# EAGLE design PrototypeMcu (EAGLE 9.2.2)
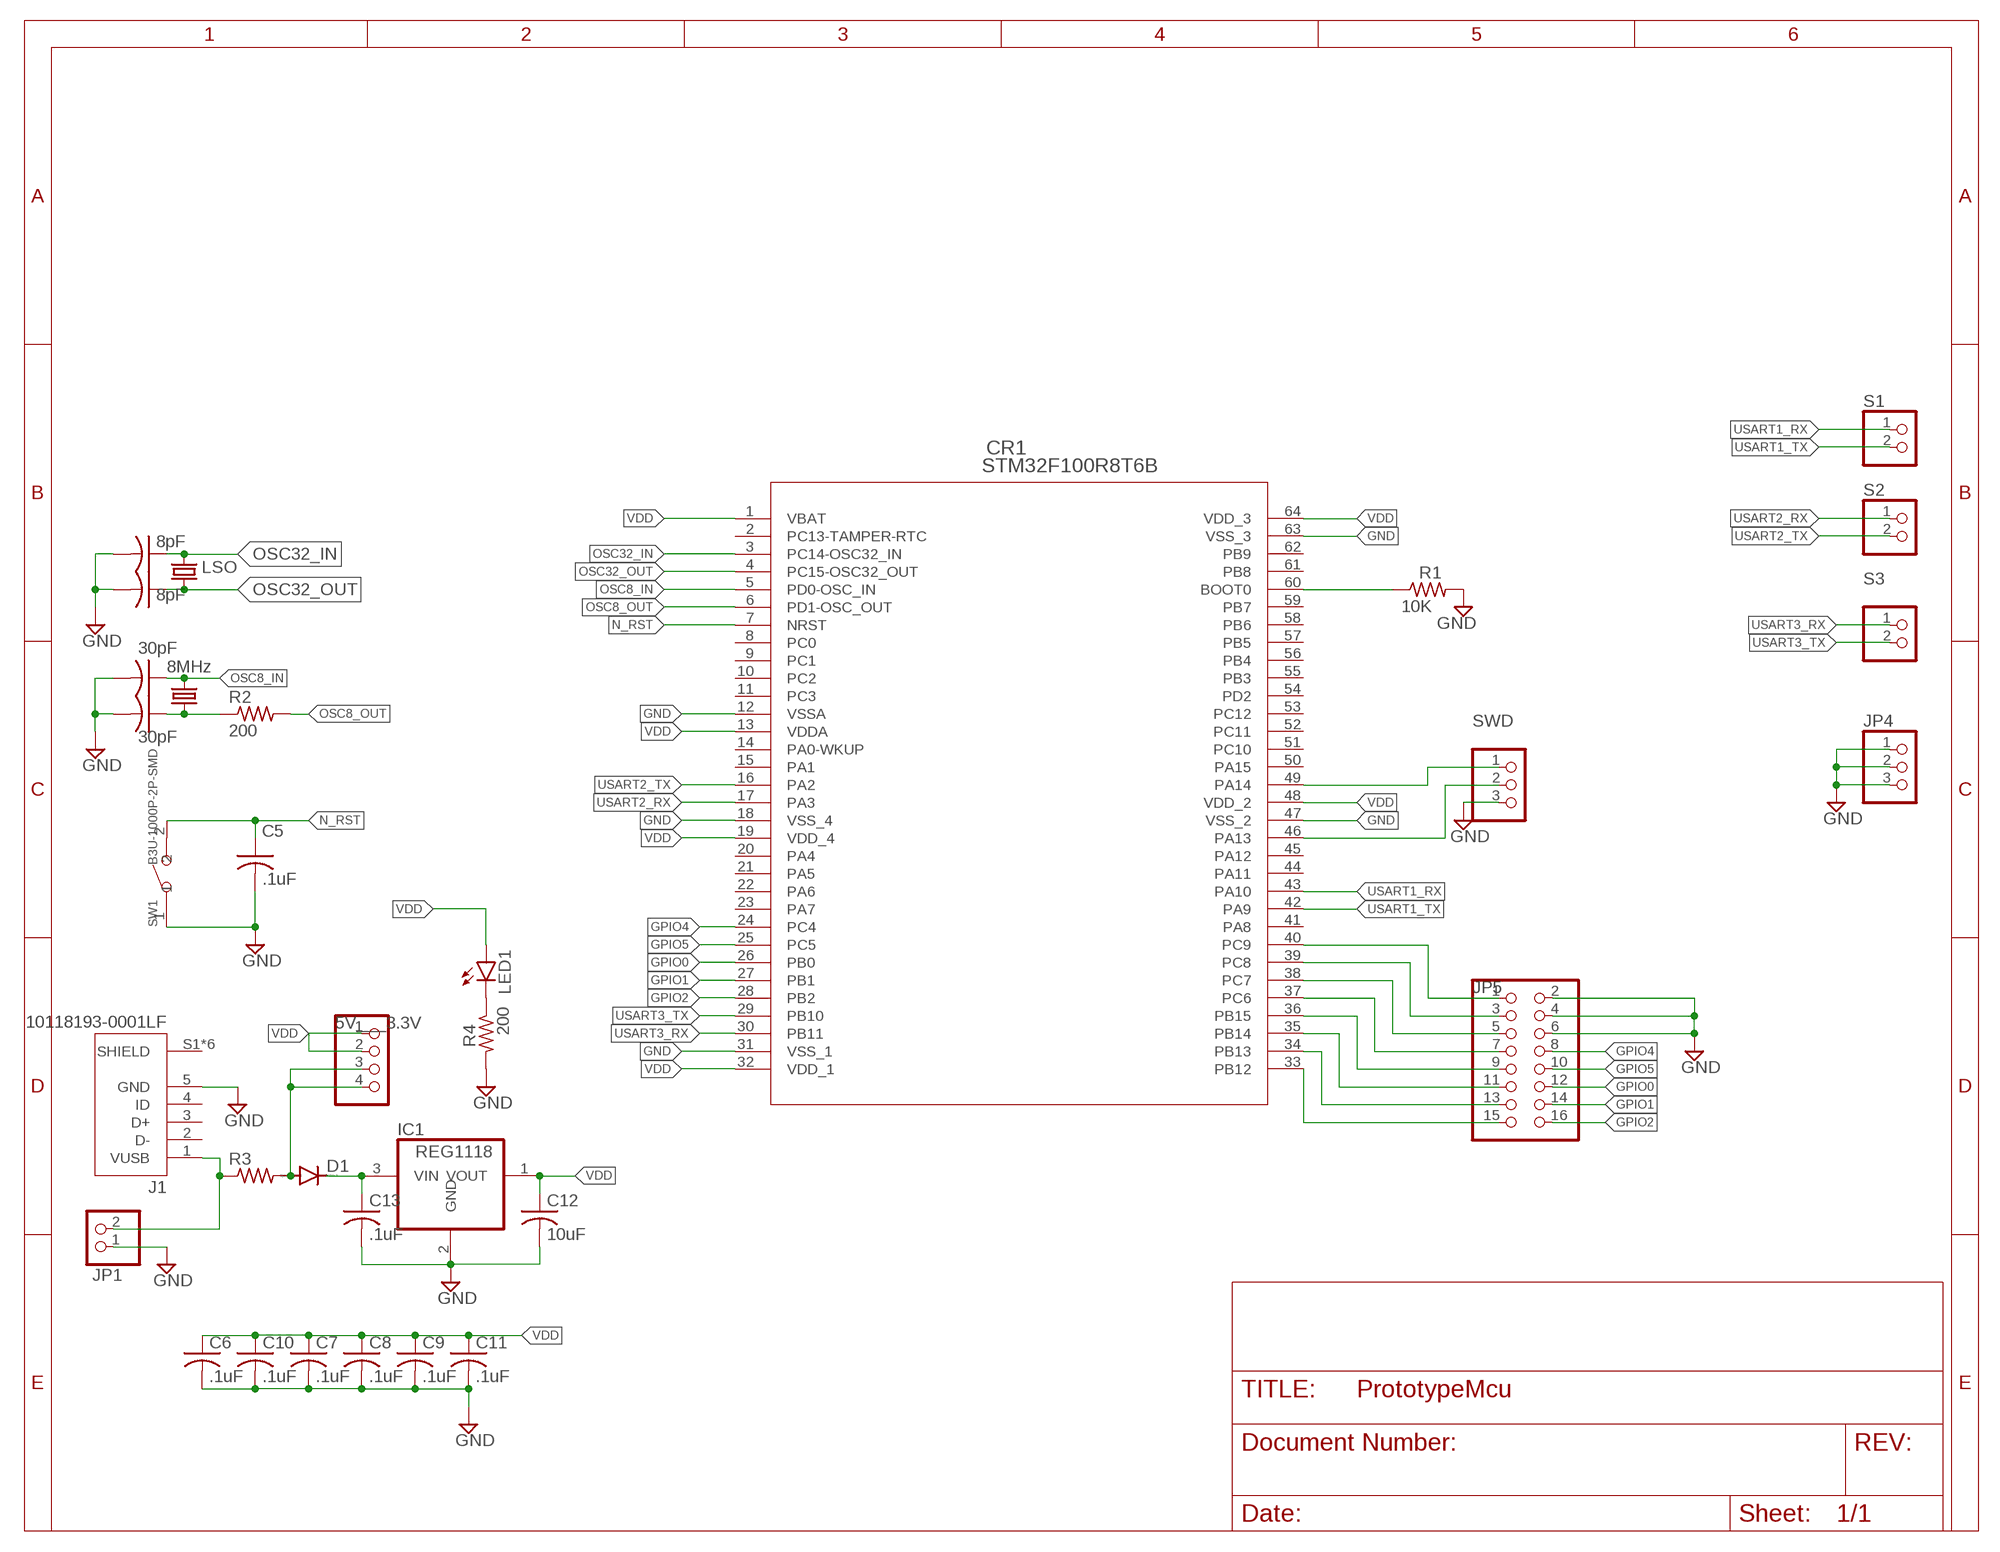
[diagram p0: schematic, sheet 1]

## Parts
5V___3.3V  PINHD-1X4  [1X04]
C1  8pF  C-USC0402  [C0402]
C2  8pF  C-USC0402  [C0402]
C3  30pF  C-USC0402  [C0402]
C4  30pF  C-USC0402  [C0402]
C5  .1uF  C-USC0402  [C0402]
C6  .1uF  C-USC0402  [C0402]
C7  .1uF  C-USC0402  [C0402]
C8  .1uF  C-USC0402  [C0402]
C9  .1uF  C-USC0402  [C0402]
C10  .1uF  C-USC0402  [C0402]
C11  .1uF  C-USC0402  [C0402]
C12  10uF  C-USC0402  [C0402]
C13  .1uF  C-USC0402  [C0402]
CR1  STM32F100R8T6B  [LQFP-64]
D1  DIODE-SOD57-10  [SOD57-10]
IC1  REG1118  [SOT223]
J1  10118193-0001LF  [FCI_10118193-0001LF]
JP1  PINHD-1X2  [1X02]
JP4  PINHD-1X3  [1X03]
JP5  PINHD-2X8  [2X08]
LED1  LEDCHIPLED_0603  [CHIPLED_0603]
LSO  CRYSTALTC26V  [TC26V]
Q1  8MHz  CRYSTALHC49S  [HC49/S]
R1  10K  R-US_R0402  [R0402]
R2  200  R-US_R0402  [R0402]
R3  R-US_M1206  [M1206]
R4  200  R-US_R0402  [R0402]
S1  PINHD-1X2  [1X02]
S2  PINHD-1X2  [1X02]
S3  PINHD-1X2  [1X02]
SW1  B3U-1000P-2P-SMD  SMD-BUTTON(2P-3.0X2.5X1.2+0.4MM)-B3U-1000P-2P-SMD  [SW2-2.6-3.0X2.5X1.2+0.4MM]
SWD  PINHD-1X3  [1X03]

## Nets
GND: C1.2 C2.2 C3.2 C4.2 C5.2 C6.2 C7.2 C8.2 C9.2 C10.2 C11.2 C12.2 C13.2 CR1.12(VSSA) CR1.18(VSS_4) CR1.31(VSS_1) CR1.47(VSS_2) CR1.63(VSS_3) IC1.2(GND) J1.5(GND) JP1.1 JP4.1 JP4.2 JP4.3 JP5.2 JP5.4 JP5.6 R1.2 R4.2 SW1.1 SWD.3
GPIO0: CR1.26(PB0) JP5.12
GPIO1: CR1.27(PB1) JP5.14
GPIO2: CR1.28(PB2) JP5.16
GPIO4: CR1.24(PC4) JP5.8
GPIO5: CR1.25(PC5) JP5.10
N$1: CR1.60(BOOT0) R1.1
N$2: C13.1 D1.C IC1.3(VIN)
N$3: CR1.40(PC9) JP5.1
N$4: 5V___3.3V.3 5V___3.3V.4 D1.A R3.2
N$5: C4.1 Q1.2 R2.1
N$6: CR1.46(PA13) SWD.2
N$7: CR1.39(PC8) JP5.3
N$8: CR1.49(PA14) SWD.1
N$9: CR1.38(PC7) JP5.5
N$10: CR1.37(PC6) JP5.7
N$11: CR1.36(PB15) JP5.9
N$12: CR1.35(PB14) JP5.11
N$13: CR1.34(PB13) JP5.13
N$14: CR1.33(PB12) JP5.15
N$15: LED1.C R4.1
N$16: J1.1(VUSB) JP1.2 R3.1
N_RST: C5.1 CR1.7(NRST) SW1.2
OSC8_IN: C3.1 CR1.5(PD0-OSC_IN) Q1.1
OSC8_OUT: CR1.6(PD1-OSC_OUT) R2.2
OSC32_IN: C1.1 CR1.3(PC14-OSC32_IN) LSO.2
OSC32_OUT: C2.1 CR1.4(PC15-OSC32_OUT) LSO.1
USART1_RX: CR1.43(PA10) S1.1
USART1_TX: CR1.42(PA9) S1.2
USART2_RX: CR1.17(PA3) S2.1
USART2_TX: CR1.16(PA2) S2.2
USART3_RX: CR1.30(PB11) S3.1
USART3_TX: CR1.29(PB10) S3.2
VDD: 5V___3.3V.1 5V___3.3V.2 C6.1 C7.1 C8.1 C9.1 C10.1 C11.1 C12.1 CR1.1(VBAT) CR1.13(VDDA) CR1.19(VDD_4) CR1.32(VDD_1) CR1.48(VDD_2) CR1.64(VDD_3) IC1.1(VOUT) LED1.A
Unconnected: CR1.2(PC13-TAMPER-RTC) CR1.8(PC0) CR1.9(PC1) CR1.10(PC2) CR1.11(PC3) CR1.14(PA0-WKUP) CR1.15(PA1) CR1.20(PA4) CR1.21(PA5) CR1.22(PA6) CR1.23(PA7) CR1.41(PA8) CR1.44(PA11) CR1.45(PA12) CR1.50(PA15) CR1.51(PC10) CR1.52(PC11) CR1.53(PC12) CR1.54(PD2) CR1.55(PB3) CR1.56(PB4) CR1.57(PB5) CR1.58(PB6) CR1.59(PB7) CR1.61(PB8) CR1.62(PB9) J1.2(D-) J1.3(D+) J1.4(ID) J1.S1(SHIELD) J1.S2(SHIELD) J1.S3(SHIELD) J1.S4(SHIELD) J1.S5(SHIELD) J1.S6(SHIELD)

## Library data of the parts
5V___3.3V = pinhead:PINHD-1X4: PIN HEADER
C1-C13 = rcl:C-US: CAPACITOR, American symbol; SPICEPREFIX: C
CR1 = MCU:STM32F100R8T6B; MANUFACTURER_PART_NUMBER: STM32F100R8T6B; VENDOR: STMicroelectronics
D1 = diode:DIODE-: DIODE
IC1 = burr-brown:REG1118: 800mA Low Dropout (LDO) Positive Regulator with Current Source and Sink Capability; MPN: REG1118-2.85/2K5G4; OC_FARNELL: unknown; OC_NEWARK: 14M2185
J1 = MicroUsb:10118193-0001LF: Micro USB B Type Receptacle; DESCRIPTION: Conn Micro USB Type B RCP 5 POS 0.65mm Solder RA SMD 5 Terminal 1 Port T/R; DIGI-KEY_PART_NUMBER: 609-4616-1-ND; DIGI-KEY_PURCHASE_URL: https://www.digikey.com/product-detail/en/amphenol-icc-fci/10118193-0001LF/609-4616-1-ND/2785380?utm_source=snapeda&utm_medium=aggregator&utm_campaign=symbol; MF: Amphenol ICC; MP: 10118193-0001LF; PACKAGE: None
JP1 S1-S3 = pinhead:PINHD-1X2: PIN HEADER
JP4 SWD = pinhead:PINHD-1X3: PIN HEADER
JP5 = pinhead:PINHD-2X8: PIN HEADER
LED1 = led:LED: LED OSRAM: - CHIPLED LG R971, LG N971, LY N971, LG Q971, LY Q971, LO R971, LY R971 LH N974, LH R974 LS Q976, LO Q976, LY Q976 LO Q996 - Hyper CHIPLED LW Q18S LB Q993, LB Q99A, LB R99A - SideLED LS A670, LO A670, LY A670, LG A670, LP A670 LB A673, LV A673, LT A673, LW A673 LH A674 LY A675 LS A676, LA A676, LO A676, LY A676, LW A676 LS A679, LY A679, LG A679 - Hyper Micro SIDELED® LS Y876, LA Y876, LO Y876, LY Y876 LT Y87S - SmartLED LW L88C, LW L88S LB L89C, LB L89S, LG L890 LS L89K, LO L89K, LY L89K LS L896, LA L896, LO L896, LY L896 - TOPLED LS T670, LO T670, LY T670, LG T670, LP T670 LSG T670, LSP T670, LSY T670, LOP T670, LYG T670 LG T671, LOG T671, LSG T671 LB T673, LV T673, LT T673, LW T673 LH T674 LS T676, LA T676, LO T676, LY T676, LB T676, LH T676, LSB T676, LW T676 LB T67C, LV T67C, LT T67C, LS T67K, LO T67K, LY T67K, LW E67C LS E67B, LA E67B, LO E67B, LY E67B, LB E67C, LV E67C, LT E67C LW T67C LS T679, LY T679, LG T679 LS T770, LO T770, LY T770, LG T770, LP T770 LB T773, LV T773, LT T773, LW T773 LH T774 LS E675, LA E675, LY E675, LS T675 LS T776, LA T776, LO T776, LY T776, LB T776 LHGB T686 LT T68C, LB T68C - Hyper Mini TOPLED® LB M676 - Mini TOPLED Santana® LG M470 LS M47K, LO M47K, LY M47K Source: http://www.osram.convergy.de LUXEON: - LUMILED® LXK2-PW12-R00, LXK2-PW12-S00, LXK2-PW14-U00, LXK2-PW14-V00 LXK2-PM12-R00, LXK2-PM12-S00, LXK2-PM14-U00 LXK2-PE12-Q00, LXK2-PE12-R00, LXK2-PE12-S00, LXK2-PE14-T00, LXK2-PE14-U00 LXK2-PB12-K00, LXK2-PB12-L00, LXK2-PB12-M00, LXK2-PB14-N00, LXK2-PB14-P00, LXK2-PB14-Q00 LXK2-PR12-L00, LXK2-PR12-M00, LXK2-PR14-Q00, LXK2-PR14-R00 LXK2-PD12-Q00, LXK2-PD12-R00, LXK2-PD12-S00 LXK2-PH12-R00, LXK2-PH12-S00 LXK2-PL12-P00, LXK2-PL12-Q00, LXK2-PL12-R00 Source: www.luxeon.com KINGBRIGHT: KA-3528ASYC Source: www.kingbright.com
LSO = crystal:CRYSTAL: CRYSTAL; OC_FARNELL: unknown; OC_NEWARK: unknown
Q1 = crystal:CRYSTAL: CRYSTAL; OC_FARNELL: 1667008; OC_NEWARK: unknown
R1-R4 = rcl:R-US_: RESISTOR, American symbol; SPICEPREFIX: R
SW1 = Seeed-Switch:SMD-BUTTON(2P-3.0X2.5X1.2+0.4MM): 311020047; MPN: B3U-1000P-2P-SMD

## Board
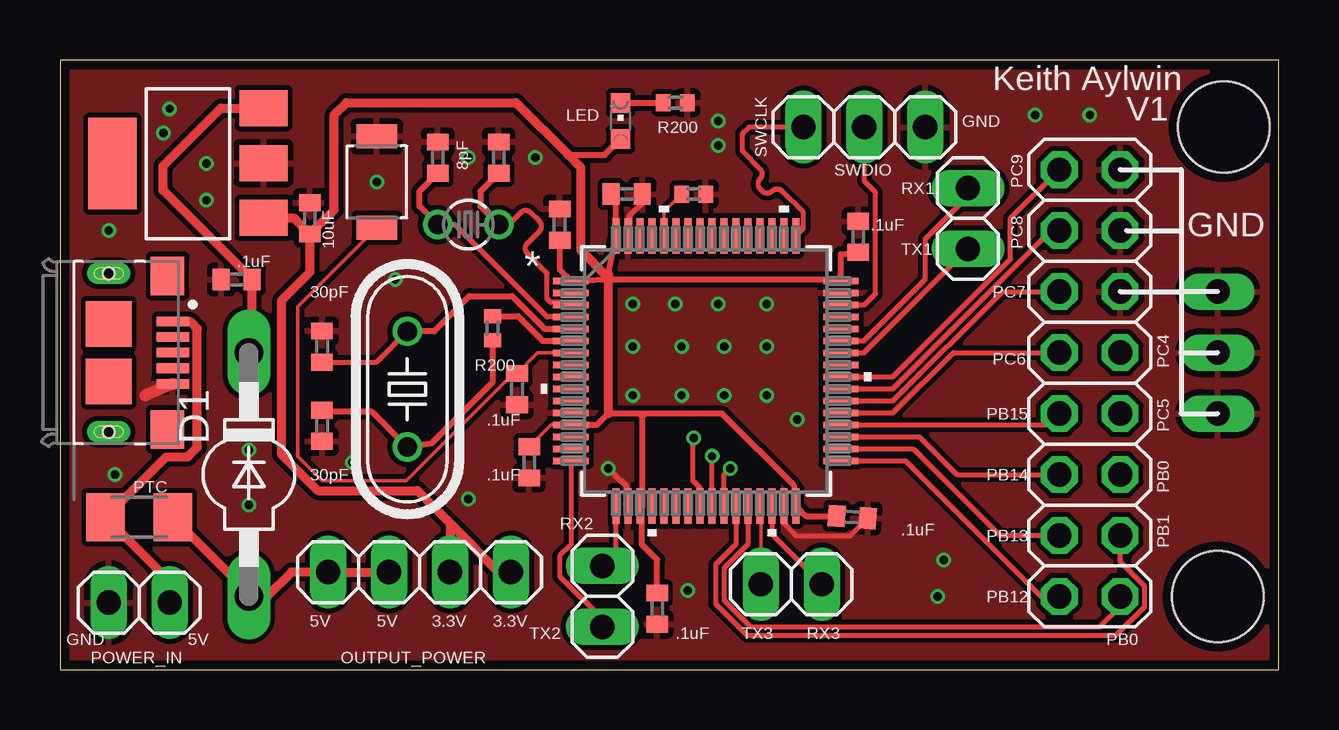
[diagram p1: board, top side]
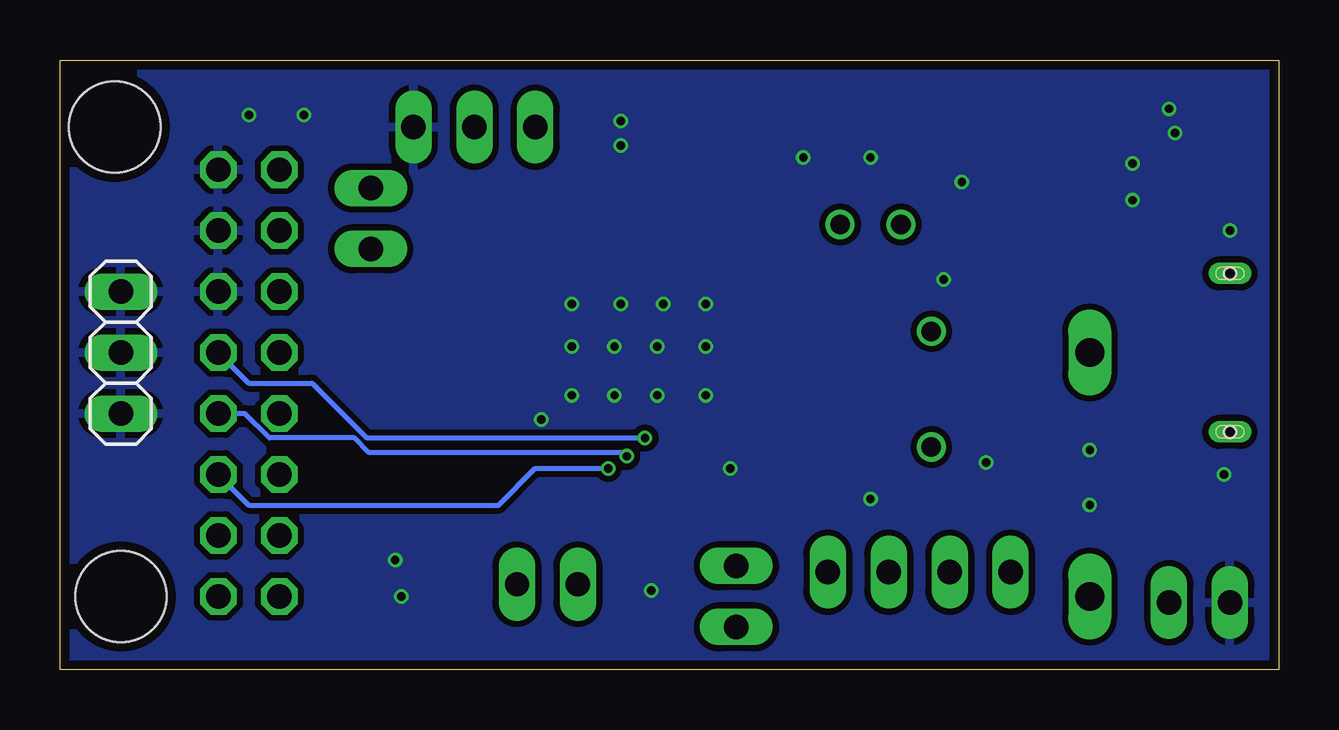
[diagram p2: board, bottom side, seen from below]

Size 50.8 x 25.4 mm. Coordinates in mm from the lower left corner, seen from the top.
Outline: 0,0 50.8,0 50.8,25.4 0,25.4 0,0
Copper layers (1*16): Top 0.035559375mm / dielectric 1.6mm / Bottom 0.035559375mm
Design rules "oshpark-2layer": minimum track width 6mil, minimum drill 10mil, track to track 6mil, track to pad 6mil, pad to pad 6mil, via to via 6mil, smd to smd 6mil, copper to edge 15mil, drill to drill 6mil, minimum pad ring 5mil, minimum via ring 5mil, stop-mask expansion 2.5mil, vias tented up to drill 0mil, thermal gap 10mil
Holes 3.81 mm at 48.26,3.05 48.51,22.61

### Footprints (pad centres in the part's own frame; a part is rotated, then mirrored left to right if it is on the bottom)
1X04 = drill 1.016 long: 1 -3.81,0; 2 -1.27,0; 3 1.27,0; 4 3.81,0
C0402 = smd 0.7 x 0.9: 1 -0.65,0; 2 0.65,0
LQFP-64 = smd 1.473 x 0.279: 1 -5.626,3.75; 2 -5.626,3.25; 3 -5.626,2.75; 4 -5.626,2.25; 5 -5.626,1.75; 6 -5.626,1.25; 7 -5.626,0.75; 8 -5.626,0.25; 9 -5.626,-0.25; 10 -5.626,-0.75; 11 -5.626,-1.25; 12 -5.626,-1.75; 13 -5.626,-2.25; 14 -5.626,-2.75; 15 -5.626,-3.25; 16 -5.626,-3.75; 33 5.626,-3.75; 34 5.626,-3.25; 35 5.626,-2.75; 36 5.626,-2.25; 37 5.626,-1.75; 38 5.626,-1.25; 39 5.626,-0.75; 40 5.626,-0.25; 41 5.626,0.25; 42 5.626,0.75; 43 5.626,1.25; 44 5.626,1.75; 45 5.626,2.25; 46 5.626,2.75; 47 5.626,3.25; 48 5.626,3.75 | smd 0.279 x 1.473: 17 -3.75,-5.626; 18 -3.25,-5.626; 19 -2.75,-5.626; 20 -2.25,-5.626; 21 -1.75,-5.626; 22 -1.25,-5.626; 23 -0.75,-5.626; 24 -0.25,-5.626; 25 0.25,-5.626; 26 0.75,-5.626; 27 1.25,-5.626; 28 1.75,-5.626; 29 2.25,-5.626; 30 2.75,-5.626; 31 3.25,-5.626; 32 3.75,-5.626; 49 3.75,5.626; 50 3.25,5.626; 51 2.75,5.626; 52 2.25,5.626; 53 1.75,5.626; 54 1.25,5.626; 55 0.75,5.626; 56 0.25,5.626; 57 -0.25,5.626; 58 -0.75,5.626; 59 -1.25,5.626; 60 -1.75,5.626; 61 -2.25,5.626; 62 -2.75,5.626; 63 -3.25,5.626; 64 -3.75,5.626
SOD57-10 = drill 1.194 long: A 5.08,0; C -5.08,0
SOT223 = smd 1.499 x 2.007: 1 -2.261,-3.15; 2 0.025,-3.15; 3 2.311,-3.15 | smd 3.81 x 2.007: 4 0,3.15
FCI_10118193-0001LF = smd 0.4 x 1.35: 1 -1.3,2.675; 2 -0.65,2.675; 3 0,2.675; 4 0.65,2.675; 5 1.3,2.675 | smd 1.6 x 1.4: S1 -3.2,2.45; S2 3.2,2.45 | smd 1.9 x 1.9: S3 1.2,0; S4 -1.2,0 | drill 0.5 pad 0.9 long: S5 -3.3,0; S6 3.3,0 | hole 0.5: -3.3,0; 3.3,0
1X02 = drill 1.016 long: 1 -1.27,0; 2 1.27,0
1X03 = drill 1.016 long: 1 -2.54,0; 2 0,0; 3 2.54,0
2X08 = drill 1.016 octagon: 1 -8.89,-1.27; 2 -8.89,1.27; 3 -6.35,-1.27; 4 -6.35,1.27; 5 -3.81,-1.27; 6 -3.81,1.27; 7 -1.27,-1.27; 8 -1.27,1.27; 9 1.27,-1.27; 10 1.27,1.27; 11 3.81,-1.27; 12 3.81,1.27; 13 6.35,-1.27; 14 6.35,1.27; 15 8.89,-1.27; 16 8.89,1.27
CHIPLED_0603 = smd 0.8 x 0.8: A 0,-0.75; C 0,0.75
TC26V = drill 0.813: 1 -1.27,0; 2 1.27,0
HC49/S = drill 0.813: 1 -2.413,0; 2 2.413,0
R0402 = smd 0.6 x 0.7: 1 -0.5,0; 2 0.5,0
M1206 = smd 1.6 x 2: 1 -1.4,0; 2 1.4,0
SW2-2.6-3.0X2.5X1.2+0.4MM = smd 1 x 1.7: 1 -1.9,0; 2 1.9,0

### Placement (x,y rotation side)
5V___3.3V  14.99,4.06 180 top
C1  18.29,21.34 90 top
C2  15.75,21.34 90 top
C3  10.92,13.46 90 top
C4  10.92,10.16 270 top
C5  19.05,11.68 270 top
C6  20.83,18.54 90 top
C7  23.62,19.81 0 top
C8  33.27,18.03 90 top
C9  19.56,8.64 270 top
C10  24.89,2.54 270 top
C11  33.02,6.35 356.2 top
C12  10.41,18.8 90 top
C13  7.37,16.26 180 top
CR1  26.92,12.45 0 top
D1  7.87,8.13 270 top
IC1  5.33,21.08 90 top
J1  2.03,13.21 270 top
JP1  3.3,2.79 0 top
JP4  48.26,13.21 90 bottom
JP5  42.93,11.94 270 top
LED1  23.37,22.86 0 top
LSO  17.02,18.54 0 top
Q1  14.48,11.68 270 top
R1  26.42,19.81 0 top
R2  18.03,14.22 90 top
R3  3.3,6.35 0 top
R4  25.65,23.62 0 top
S1  37.85,18.8 270 top
S2  22.61,3.05 270 top
S3  30.48,3.56 180 top
SW1  13.21,20.32 270 top
SWD  33.53,22.61 0 top

### Tracks (layer width: path | path; a pad name or v marks a point on that pad's centre or on a via)
GND  (via drill 0.35)
  Top 0.203: C11.2 32.94,5.57 30.68,5.57 30.57,5.68 30.21,6.05 30.17,6.08 CR1.31
  Top 0.254: CR1.47 32.56,15.68 | 23.59,7.39 23.59,7.67 23.43,7.84 23.41,7.84 v22.86,8.38 | 23.59,7.39 23.62,7.37 | 23.59,7.39 23.59,6.9 CR1.18 | R1.2 | CR1.63 23.75,18.15 23.75,18.92 24.27,19.44 C7.2
  Top 0.508: J1.5 3.56,11.43
  other vias: 23.88,15.24 25.65,15.24 27.43,15.24 29.46,15.24 23.88,13.46 25.91,13.46 27.69,13.46 29.46,13.46 23.88,11.43 25.91,11.43 27.69,11.43 29.46,11.43 36.83,4.57 36.58,3.05 6.1,21.08 6.1,19.56 2.03,18.29 7.87,9.14 17.02,7.11 7.87,6.86 26.16,3.3 12.19,8.64 19.81,21.34 13.97,16.26 2.29,8.13 27.43,22.86 27.43,21.84 40.64,23.11 42.93,23.11 4.57,23.37 4.32,22.35 30.73,10.41 13.21,20.32 17.02,21.34
  pour Top (isolate 0.203): 0,25.4 0,0 50.8,0 50.8,25.4
  pour Bottom (isolate 0.254): 0,25.4 0,0 50.8,0 50.8,25.4
GPIO0  (via drill 0.35)
  Top 0.203: CR1.26 27.67,8.12 v27.94,8.38
  Bottom 0.203: JP5.12 42.93,6.86 32.51,6.86 30.99,8.38 v27.94,8.38
GPIO1
  Top 0.203: CR1.27 28.17,5.22 27.33,4.38 27.33,2.73 28.64,1.42 44.01,1.42 45.21,2.63 45.21,3.47 44.2,4.49 JP5.14
GPIO2
  Top 0.203: JP5.16 44.2,2.63 43.35,1.78 28.79,1.78 27.69,2.88 27.69,4.23 28.67,5.22 CR1.28
GPIO4  (via drill 0.35)
  Top 0.203: v26.42,9.65 26.37,9.6 26.37,7.89 26.67,7.58 CR1.24
  Bottom 0.203: v26.42,9.65 38.01,9.65 40.3,11.94 42.93,11.94 JP5.8
GPIO5  (via drill 0.35)
  Top 0.203: CR1.25 v27.17,8.89 v27.18,8.89
  Bottom 0.203: JP5.10 43.09,10.67 42.08,9.65 38.52,9.65 37.91,9.04 27.33,9.04 v27.18,8.89
N$1
  Top 0.152: CR1.60 25.17,19.07 R1.1
N$2
  Top 0.381: IC1.3 6.71,23.39 4.3,20.99 4.3,19.97 C13.1 8.02,13.35 D1.C
N$3
  Top 0.203: JP5.1 39.62,18.8 39.62,17.11 34.72,12.2 CR1.40
N$4
  Top 0.381: 5V___3.3V.3 5V___3.3V.4 9.65,4.06 8.64,3.05 D1.A 7.87,3.18 R3.2
N$5
  Top 0.254: R2.1 18.03,11.98 15.47,9.42 Q1.2 13.01,10.74 10.99,10.74 C4.1
N$6
  Top 0.203: SWD.2 33.53,20.35 33.99,19.89 33.99,15.66 33.53,15.2 CR1.46
N$7
  Top 0.203: JP5.3 41.31,18.29 34.72,11.7 CR1.39
N$8
  Top 0.203: CR1.49 30.99,18.39 30.99,19.05 30.1,19.94 arc90 29.69,19.94 arc-90 29.27,19.94 29.18,20.03 arc-90 29.18,20.45 arc90 29.18,20.86 28.45,21.59 28.45,22.34 28.71,22.61 SWD.1
N$9
  Top 0.203: JP5.5 39.27,15.75 34.72,11.2 CR1.38
N$10
  Top 0.203: JP5.7 37.24,13.21 34.72,10.7 CR1.37
N$11
  Top 0.203: JP5.9 41.18,10.2 CR1.36
N$12
  Top 0.203: JP5.11 37.39,8.13 35.83,9.7 CR1.35
N$13
  Top 0.203: JP5.13 39.18,5.59 35.57,9.2 CR1.34
N$14
  Top 0.203: CR1.33 35.25,8.7 40.89,3.05 JP5.15
N$15
  Top 0.254: LED1.C 23.38,23.62 R4.1
N$16
  Top 0.381: JP1.2 4.57,3.68 R3.1 4.42,8.87 5.32,8.87 5.72,9.27 5.72,14.21 5.42,14.51 J1.1
N_RST
  Top 0.152: CR1.7 19.91,13.2 C5.1 18.89,12.33 14.44,7.87 10.92,7.87 9.91,8.89 9.91,15.12 SW1.2
OSC8_IN
  Top 0.203: C3.1 13.19,12.81 Q1.1
  Top 0.254: Q1.1 15.6,14.1 17.06,15.56 18.84,15.56 20.2,14.2 CR1.5
OSC8_OUT
  Top 0.254: R2.2 19.09,14.72 20.12,13.7 CR1.6
OSC32_IN
  Top 0.203: CR1.3 21.19,15.3 20.46,15.3 20.31,15.45 20.31,16.52 19.48,17.35 arc-90 19.48,17.76 19.98,18.27 arc90 19.98,18.68 19.62,19.05 arc90 19.2,19.05 18.7,18.54 arc-90 LSO.2
  Top 0.254: C1.1 17.53,19.92 17.53,19.3 LSO.2
OSC32_OUT
  Top 0.152: CR1.4 20.86,14.7
  Top 0.203: LSO.1 16.46,18.54 20.31,14.7 20.86,14.7
  Top 0.254: LSO.1 14.99,19.3 14.99,19.92 C2.1
USART1_RX
  Top 0.203: CR1.43 33.51,13.7 36.07,16.26 36.07,17.95 37.85,19.73 S1.1
USART1_TX
  Top 0.203: CR1.42 33.52,13.2 S1.2
USART2_RX
  Top 0.203: S2.1 23.17,4.89 CR1.17
USART2_TX
  Top 0.203: CR1.16 21.3,5.21 20.83,4.74 20.83,3.9 22.61,2.12 S2.2
USART3_RX
  Top 0.203: S3.1 29.67,5.63 CR1.30
USART3_TX
  Top 0.152: CR1.29 29.21,6.78 S3.2
VDD
  Top 0.152: C9.1 20.47,10.2 CR1.13
  Top 0.254: 22.83,16.36 22.86,16.51 CR1.64 23.17,19.76 C7.1 | 24.25,6.74 CR1.19 | 24.25,6.74 24.25,5.21 24.89,4.57 C10.1 | C8.1 32.55,17.31 CR1.48 32.49,16.26 22.86,16.26 CR1.1 20.83,16.67 C6.1 | 24.38,10.67 27.6,10.67 30.59,7.67 30.59,6.9 CR1.32 31.1,6.39 C11.1 | 24.38,10.67 22.85,10.67 22.38,10.2 CR1.13 | 21.19,21.44 22.7,21.44 LED1.A | 24.38,10.67 24.25,10.54 24.25,6.74
  Top 0.381: IC1.1 9.74,18.82 C12.1 | 22.86,16.51 22.86,16.26 22.85,16.25 22.85,10.67 | 16.26,6.1 5V___3.3V.2 | 16.26,6.1 14.9,7.46 10.75,7.46 9.22,8.98 9.22,15.37 10.41,16.56 C12.1 | C12.1 11.43,19.16 11.43,23.11 11.94,23.62 19.01,23.62 21.19,21.44 21.7,20.93 21.7,17.48 22.83,16.36 | 16.26,6.1 18.29,4.06 5V___3.3V.1

### Text on the board
tPlace: Keith Aylwin | LED | GND | V1 | R200 | 8pF | SWCLK | SWDIO | RX1 | PC9 | 10uF | .1uF | PC8 | GND | .1uF | TX1 | 30pF | PC7 | PC4 | PC6 | R200 | .1uF | PB15 | PC5 | 30pF | .1uF | PB14 | PTC | PB0 | RX2 | .1uF | PB13 | PB1 | PB12 | 5V | 5V | 3.3V | 3.3V | TX3 | RX3 | PB0 | GND | 5V | TX2 | .1uF | POWER_IN | OUTPUT_POWER